# EAGLE schematic Fluorometer (EAGLE 9.6.2)
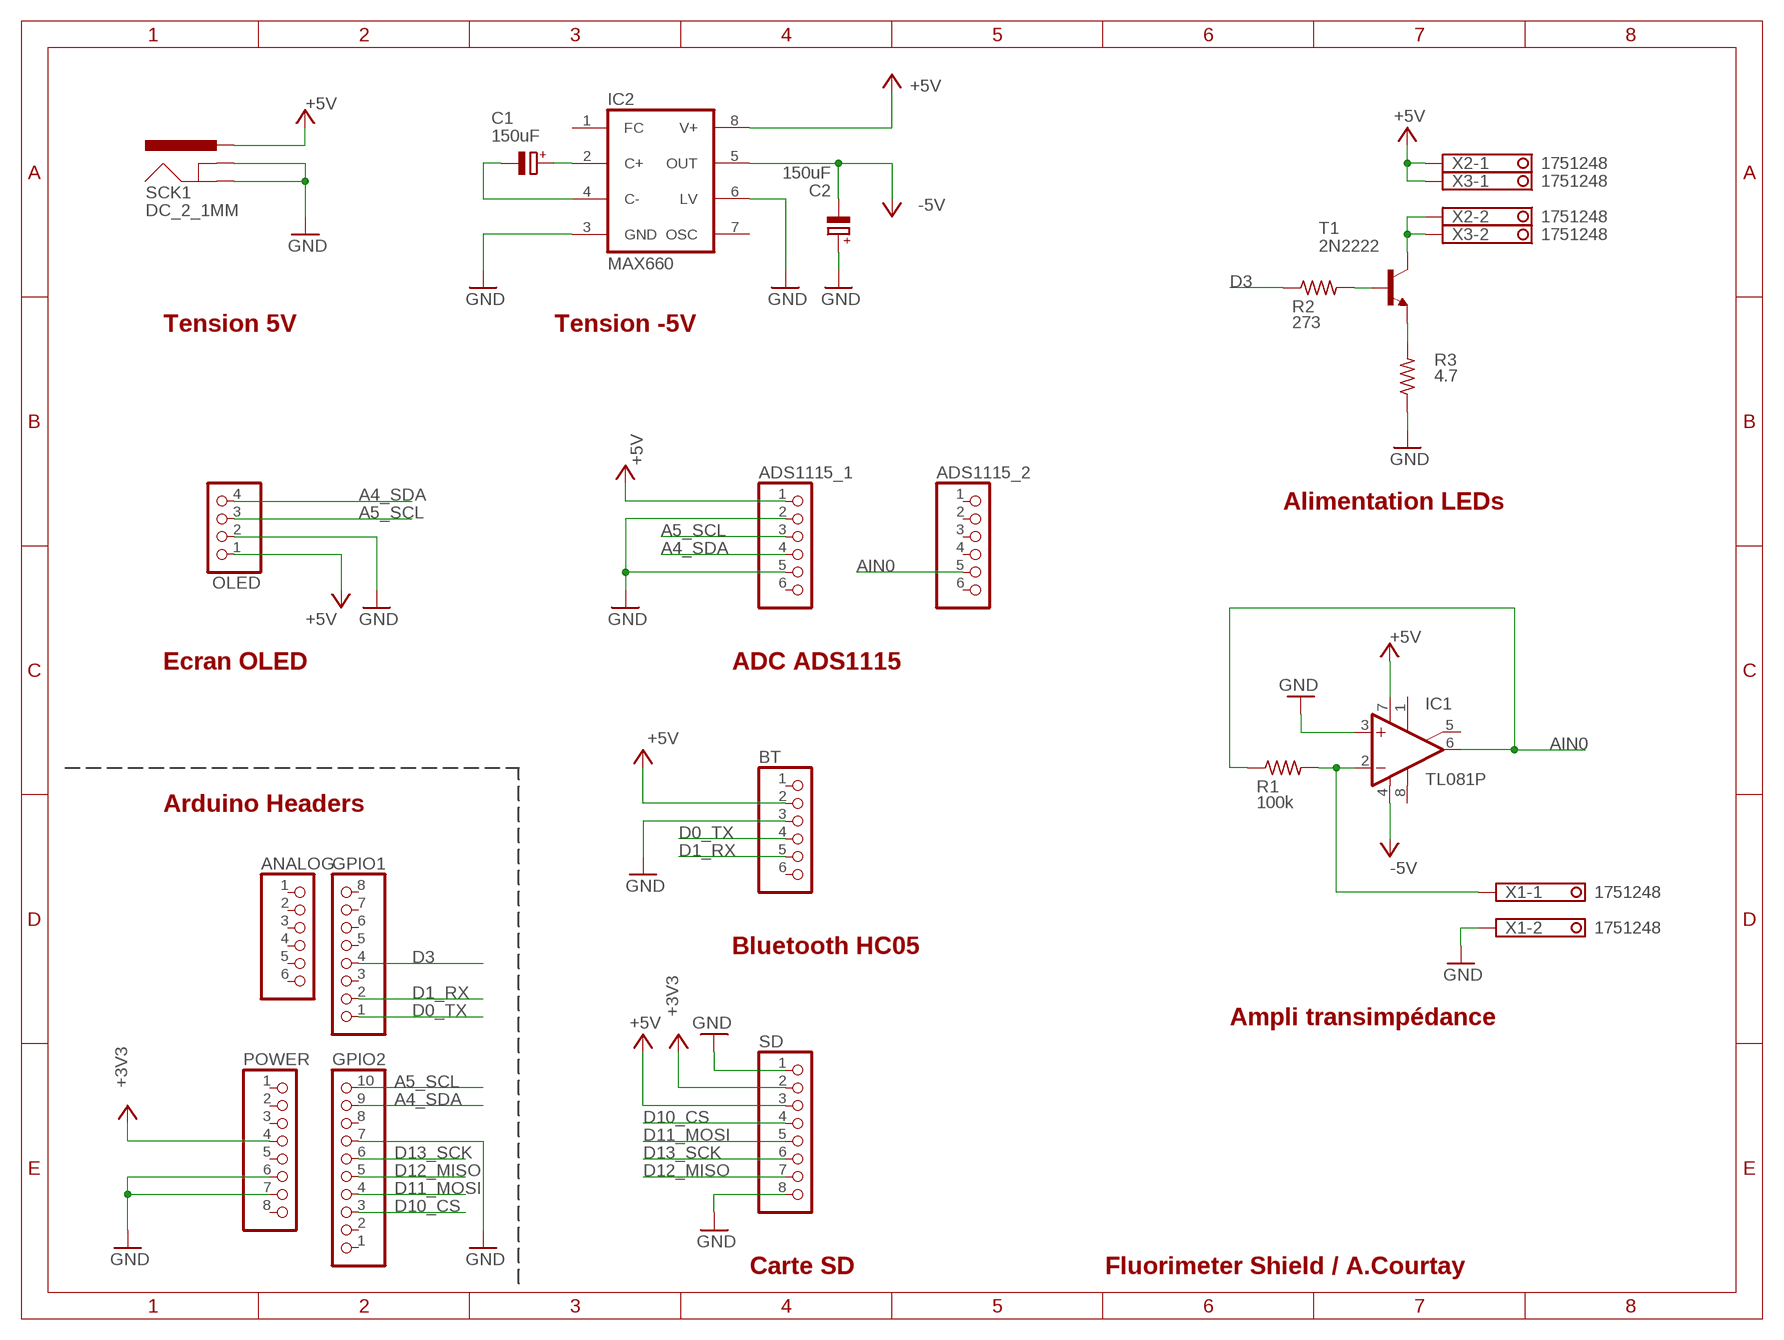
[diagram p0: schematic, sheet 1]

## Parts
ADS1115_1  PINHD-1X6  [1X06]
ADS1115_2  PINHD-1X6  [1X06]
ANALOG  PINHD-1X6  [1X06]
BT  PINHD-1X6  [1X06]
C1  150uF  CPOL-EUE2.5-7  [E2,5-7]
C2  150uF  CPOL-EUE2.5-7  [E2,5-7]
GPIO1  PINHD-1X8  [1X08]
GPIO2  PINHD-1X10  [1X10]
IC1  TL081P  [DIL08]
IC2  MAX660  MAX660CPA  [DIL08]
OLED  PINHD-1X4  [1X04]
POWER  PINHD-1X8  [1X08]
R1  100k  R-US_0204/7  [0204/7]
R2  273  R-US_0204/7  [0204/7]
R3  4.7  R-US_0204/7  [0204/7]
SCK1  DC_2_1MM  POWER_JACKPTH  [POWER_JACK_PTH]
SD  PINHD-1X8  [1X08]
T1  2N2222  [TO18]
X1  1751248  [1751248]
X2  1751248  [1751248]
X3  1751248  [1751248]

## Nets
+3V3: POWER.4 SD.2
+5V: ADS1115_1.1 BT.2 IC1.7(V+) IC2.8(V+) OLED.1 SCK1.PWR SD.3 X2.1 X3.1
-5V: C2.- IC1.4(V-) IC2.5(OUT)
A4_SDA: ADS1115_1.4 GPIO2.9 OLED.4
A5_SCL: ADS1115_1.3 GPIO2.10 OLED.3
AIN0: ADS1115_2.5 IC1.6(OUT) R1.1
D0_TX: BT.4 GPIO1.1
D1_RX: BT.5 GPIO1.2
D3: GPIO1.4 R2.1
D10_CS: GPIO2.3 SD.4
D11_MOSI: GPIO2.4 SD.5
D12_MISO: GPIO2.5 SD.7
D13_SCK: GPIO2.6 SD.6
GND: ADS1115_1.2 ADS1115_1.5 BT.3 C2.+ GPIO2.7 IC1.3(+IN) IC2.3(GND) IC2.6(LV) OLED.2 POWER.6 POWER.7 R3.1 SCK1.GND SCK1.GNDBREAK SD.1 SD.8 X1.2
N$1: IC1.2(-IN) R1.2 X1.1
N$2: R2.2 T1.2(B)
N$3: R3.2 T1.1(E)
N$4: T1.3(C) X2.2 X3.2
N$5: C1.+ IC2.2(C+)
N$6: C1.- IC2.4(C-)
Unconnected: ADS1115_1.6 ADS1115_2.1 ADS1115_2.2 ADS1115_2.3 ADS1115_2.4 ADS1115_2.6 ANALOG.1 ANALOG.2 ANALOG.3 ANALOG.4 ANALOG.5 ANALOG.6 BT.1 BT.6 GPIO1.3 GPIO1.5 GPIO1.6 GPIO1.7 GPIO1.8 GPIO2.1 GPIO2.2 GPIO2.8 IC1.1(ON1) IC1.5(ON2) IC1.8(OPT) IC2.1(FC) IC2.7(OSC) POWER.1 POWER.2 POWER.3 POWER.5 POWER.8

## Notes on the sheet
- Tension 5V | Tension -5V
- Alimentation LEDs
- Ecran OLED | ADC ADS1115
- Arduino Headers
- Bluetooth HC05
- Ampli transimpédance
- Carte SD | Fluorimeter Shield / A.Courtay

## Library data of the parts
ADS1115_1 ADS1115_2 ANALOG BT = pinhead:PINHD-1X6: PIN HEADER
C1 C2 = rcl:CPOL-EU: POLARIZED CAPACITOR, European symbol; SPICEPREFIX: C
GPIO1 POWER SD = pinhead:PINHD-1X8: PIN HEADER
GPIO2 = pinhead:PINHD-1X10: PIN HEADER
IC1 = linear:TL081: OP AMP
IC2 = maxim:MAX660CPA: Charge-pump VOLTAGE CONVERTER; MF: MAXIM; MPN: MAX660CPA; OC_FARNELL: 1187928; OC_NEWARK: 34C3964
OLED = pinhead:PINHD-1X4: PIN HEADER
R1-R3 = rcl:R-US_: RESISTOR, American symbol; SPICEPREFIX: R
SCK1 = freetronics:POWER_JACK: Power Jack This is the standard 5.5mm barrel jack for power. The PTH is the most common, proven, reliable, footprint. All others are experimental. The Slot footprint only works if the mill layer is transmitted to the PCB fab house so be warned. Spark Fun Electronics SKU : PRT-00119. Mating wall wart : TOL-00298 (and others)
T1 = transistor:2N2222: NPN TRANSISTOR
X1-X3 = con-phoenix-350:1751248: MKDS 1/ 2-3,5 Printklemme Nennstrom: 10 A Bemessungsspannung: 160 V Raster: 3,5 mm Polzahl: 2 Montageart: Löten Anschlussart: Schraubanschluss Anschlussrichtung vom Leiter zur Platine: 0° Source: http://eshop.phoenixcontact.com .. 1751248.pdf; OC_FARNELL: unknown; OC_NEWARK: unknown